# EAGLE design LispBadgeLE (EAGLE 7.6.0)
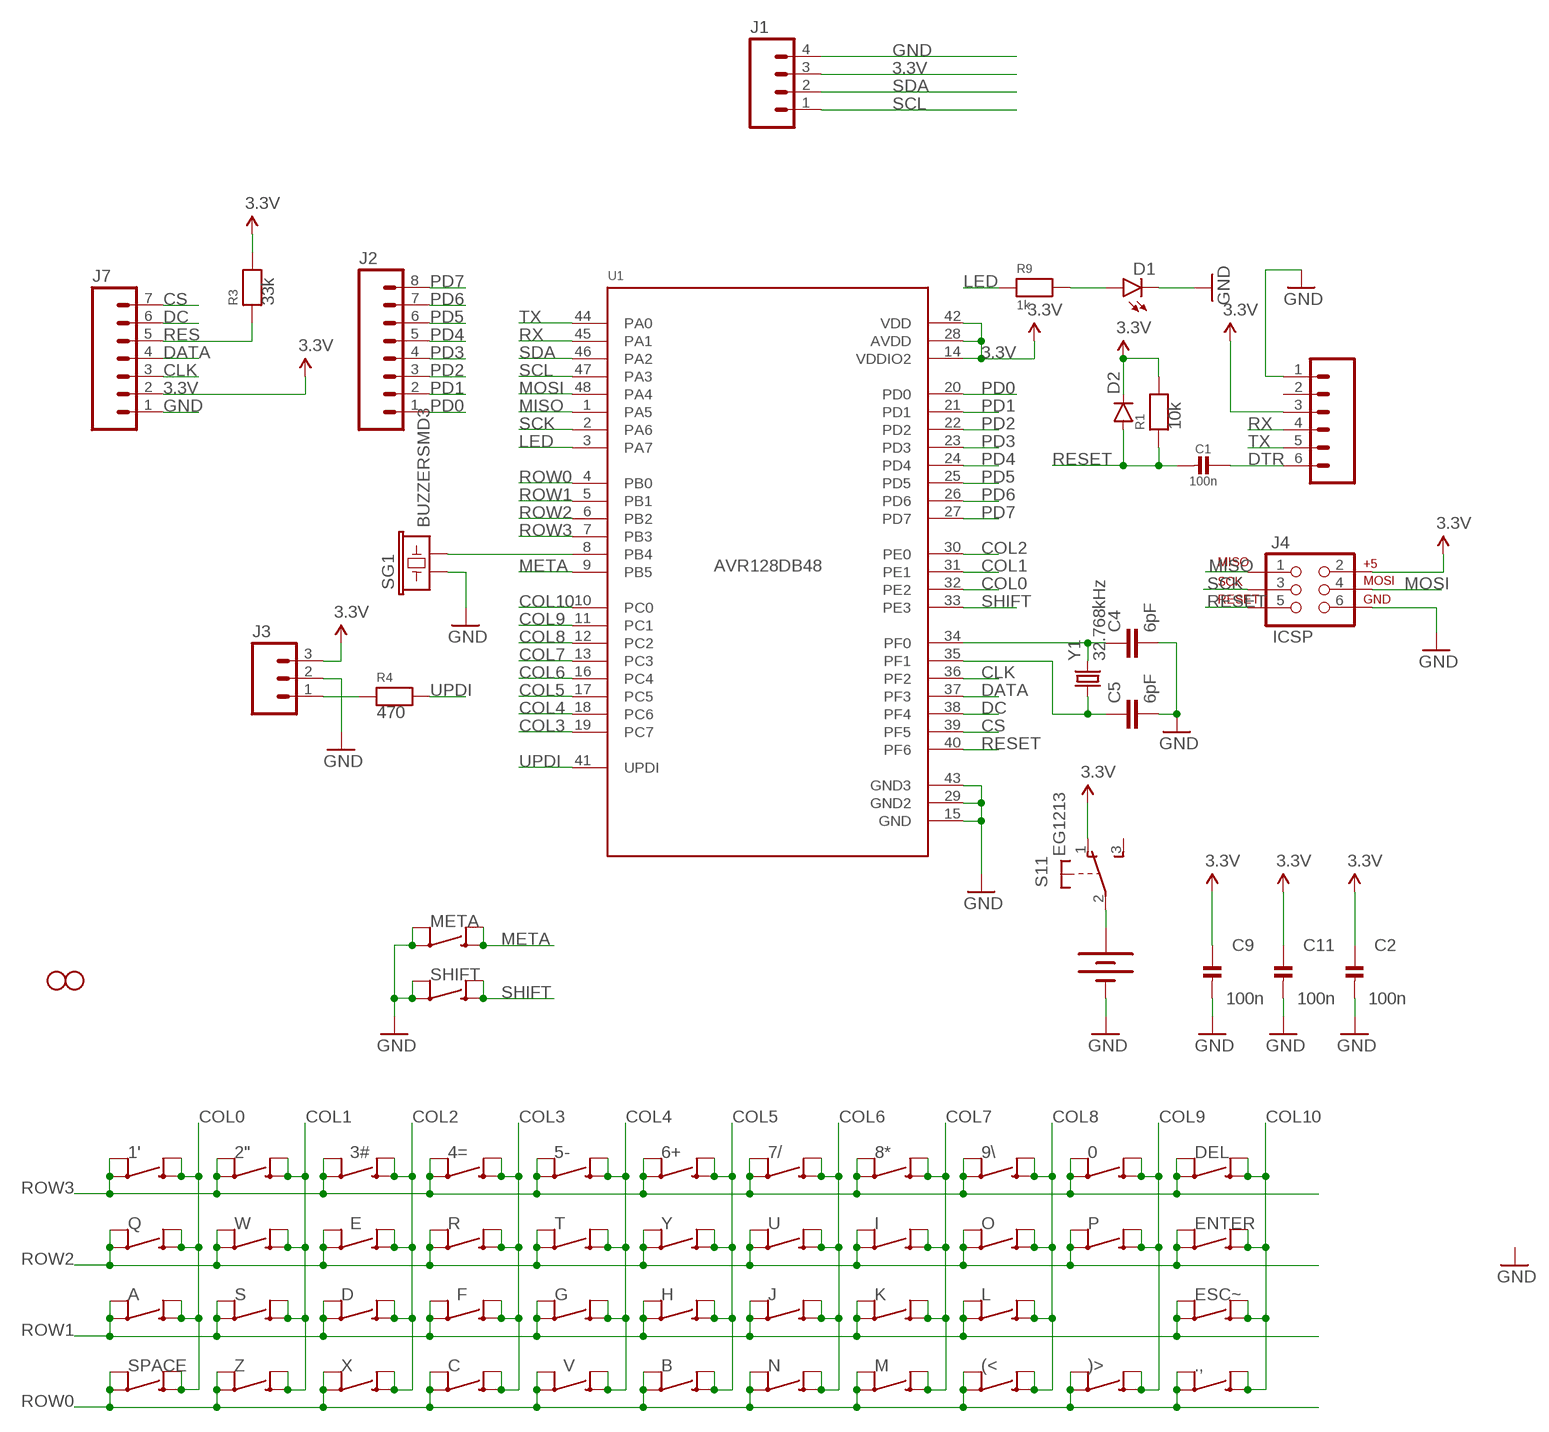
[diagram p0: schematic, sheet 1]

## Parts
0  SWITCH-MOMENTARY-2SMD-4  [TACTILE_SWITCH_TALL]
1'  SWITCH-MOMENTARY-2SMD-4  [TACTILE_SWITCH_TALL]
2"  SWITCH-MOMENTARY-2SMD-4  [TACTILE_SWITCH_TALL]
3#  SWITCH-MOMENTARY-2SMD-4  [TACTILE_SWITCH_TALL]
4=  SWITCH-MOMENTARY-2SMD-4  [TACTILE_SWITCH_TALL]
5-  SWITCH-MOMENTARY-2SMD-4  [TACTILE_SWITCH_TALL]
6+  SWITCH-MOMENTARY-2SMD-4  [TACTILE_SWITCH_TALL]
7/  SWITCH-MOMENTARY-2SMD-4  [TACTILE_SWITCH_TALL]
8*  SWITCH-MOMENTARY-2SMD-4  [TACTILE_SWITCH_TALL]
9\\  SWITCH-MOMENTARY-2SMD-4  [TACTILE_SWITCH_TALL]
(<  SWITCH-MOMENTARY-2SMD-4  [TACTILE_SWITCH_TALL]
)>  SWITCH-MOMENTARY-2SMD-4  [TACTILE_SWITCH_TALL]
.,  SWITCH-MOMENTARY-2SMD-4  [TACTILE_SWITCH_TALL]
A  SWITCH-MOMENTARY-2SMD-4  [TACTILE_SWITCH_TALL]
B  SWITCH-MOMENTARY-2SMD-4  [TACTILE_SWITCH_TALL]
BAT1  20mm coincell  BATTERY20MM_4LEGS  [BATTCON_20MM_4LEGS]
C  SWITCH-MOMENTARY-2SMD-4  [TACTILE_SWITCH_TALL]
C1  100n  CAP_CERAMIC_0805MP  [_0805MP]
C2  100n  CAP_CERAMIC_0805MP  [_0805MP]
C4  6pF  CAP0805  [0805]
C5  6pF  CAP0805  [0805]
C9  100n  CAP_CERAMIC_0805MP  [_0805MP]
C11  100n  CAP_CERAMIC_0805MP  [_0805MP]
D  SWITCH-MOMENTARY-2SMD-4  [TACTILE_SWITCH_TALL]
D1  LED1206-BOTTOM  [LED-1206-BOTTOM]
D2  DIODESOD123  [SOD-123]
DEL  SWITCH-MOMENTARY-2SMD-4  [TACTILE_SWITCH_TALL]
E  SWITCH-MOMENTARY-2SMD-4  [TACTILE_SWITCH_TALL]
ENTER  SWITCH-MOMENTARY-2SMD-4  [TACTILE_SWITCH_TALL]
ESC~  SWITCH-MOMENTARY-2SMD-4  [TACTILE_SWITCH_TALL]
F  SWITCH-MOMENTARY-2SMD-4  [TACTILE_SWITCH_TALL]
G  SWITCH-MOMENTARY-2SMD-4  [TACTILE_SWITCH_TALL]
H  SWITCH-MOMENTARY-2SMD-4  [TACTILE_SWITCH_TALL]
I  SWITCH-MOMENTARY-2SMD-4  [TACTILE_SWITCH_TALL]
J  SWITCH-MOMENTARY-2SMD-4  [TACTILE_SWITCH_TALL]
J1  M04LONGPADS  [1X04_LONGPADS]
J2  M08LONGPADS  [1X08_LONGPADS]
J3  M03LONGPADS  [1X03_LONGPADS]
J4  ICSP  AVR_SPI_PRG_6PTH  [2X3]
J7  M07  [1X07]
JP1  M06LONGPADS  [1X06_LONGPADS]
JP4  STAND-OFF  [STAND-OFF]
JP5  STAND-OFF  [STAND-OFF]
K  SWITCH-MOMENTARY-2SMD-4  [TACTILE_SWITCH_TALL]
L  SWITCH-MOMENTARY-2SMD-4  [TACTILE_SWITCH_TALL]
M  SWITCH-MOMENTARY-2SMD-4  [TACTILE_SWITCH_TALL]
META  SWITCH-MOMENTARY-2SMD-4  [TACTILE_SWITCH_TALL]
N  SWITCH-MOMENTARY-2SMD-4  [TACTILE_SWITCH_TALL]
O  SWITCH-MOMENTARY-2SMD-4  [TACTILE_SWITCH_TALL]
P  SWITCH-MOMENTARY-2SMD-4  [TACTILE_SWITCH_TALL]
Q  SWITCH-MOMENTARY-2SMD-4  [TACTILE_SWITCH_TALL]
R  SWITCH-MOMENTARY-2SMD-4  [TACTILE_SWITCH_TALL]
R1  10k  RESISTOR_0805MP  [_0805MP]
R3  33k  RESISTOR_0805MP  [_0805MP]
R4  470  RESISTOR_0805MP  [_0805MP]
R9  1k  RESISTOR_0805MP  [_0805MP]
S  SWITCH-MOMENTARY-2SMD-4  [TACTILE_SWITCH_TALL]
S1  EG1213  [EG1213]
SG1  BUZZERSMD3  [BUZZER-CMT1102]
SHIFT  SWITCH-MOMENTARY-2SMD-4  [TACTILE_SWITCH_TALL]
SPACE  SWITCH-MOMENTARY-2SMD-4  [TACTILE_SWITCH_TALL]
T  SWITCH-MOMENTARY-2SMD-4  [TACTILE_SWITCH_TALL]
U  SWITCH-MOMENTARY-2SMD-4  [TACTILE_SWITCH_TALL]
U1  AVR128DB48  [LQFP48]
V  SWITCH-MOMENTARY-2SMD-4  [TACTILE_SWITCH_TALL]
W  SWITCH-MOMENTARY-2SMD-4  [TACTILE_SWITCH_TALL]
X  SWITCH-MOMENTARY-2SMD-4  [TACTILE_SWITCH_TALL]
Y  SWITCH-MOMENTARY-2SMD-4  [TACTILE_SWITCH_TALL]
Y1  32.768kHz  CRYSTAL3.2X1.5MM  [CRYSTAL-SMD-3.2X1.5MM]
Z  SWITCH-MOMENTARY-2SMD-4  [TACTILE_SWITCH_TALL]

## Nets
3.3V: C2.1 C9.1 C11.1 D2.C J1.3 J3.3 J4.2 J7.2 JP1.3 R1.2 R3.2 S1.1(1:O) U1.14(VDDIO2) U1.28(AVDD) U1.42(VDD)
CLK: J7.3 U1.36(PF2)
COL0: 1'.B1 1'.B2 A.B1 A.B2 Q.B1 Q.B2 SPACE.B1 SPACE.B2 U1.32(PE2)
COL1: 2".B1 2".B2 S.B1 S.B2 U1.31(PE1) W.B1 W.B2 Z.B1 Z.B2
COL2: 3#.B1 3#.B2 D.B1 D.B2 E.B1 E.B2 U1.30(PE0) X.B1 X.B2
COL3: 4=.B1 4=.B2 C.B1 C.B2 F.B1 F.B2 R.B1 R.B2 U1.19(PC7)
COL4: 5-.B1 5-.B2 G.B1 G.B2 T.B1 T.B2 U1.18(PC6) V.B1 V.B2
COL5: 6+.B1 6+.B2 B.B1 B.B2 H.B1 H.B2 U1.17(PC5) Y.B1 Y.B2
COL6: 7/.B1 7/.B2 J.B1 J.B2 N.B1 N.B2 U1.16(PC4) U.B1 U.B2
COL7: 8*.B1 8*.B2 I.B1 I.B2 K.B1 K.B2 M.B1 M.B2 U1.13(PC3)
COL8: 9\\.B1 9\\.B2 (<.B1 (<.B2 L.B1 L.B2 O.B1 O.B2 U1.12(PC2)
COL9: 0.B1 0.B2 )>.B1 )>.B2 P.B1 P.B2 U1.11(PC1)
COL10: .,.B1 .,.B2 DEL.B1 DEL.B2 ENTER.B1 ENTER.B2 ESC~.B1 ESC~.B2 U1.10(PC0)
CS: J7.7 U1.39(PF5)
DATA: J7.4 U1.37(PF3)
DC: J7.6 U1.38(PF4)
DTR: C1.1 JP1.6
GND: BAT1.NEGATIVE(-) C2.2 C4.2 C5.2 C9.2 C11.2 D1.C J1.4 J3.2 J4.6 J7.1 JP1.1 META.A1 META.A2 SG1.1 SHIFT.A1 SHIFT.A2 U1.15(GND) U1.29(GND2) U1.43(GND3)
LED: R9.1 U1.3(PA7)
META: META.B1 META.B2 U1.9(PB5)
MISO: J4.1 U1.1(PA5)
MOSI: J4.4 U1.48(PA4)
N$1: C5.1 U1.35(PF1) Y1.P$1
N$2: C4.1 U1.34(PF0) Y1.P$2
N$3: D1.A R9.2
N$5: BAT1.POSITIVE@1(+) BAT1.POSITIVE@2(+) BAT1.POSITIVE@3(+) BAT1.POSITIVE@4(+) S1.2(1:P)
N$6: SG1.2 U1.8(PB4)
N$8: J3.1 R4.1
PD0: J2.1 U1.20(PD0)
PD1: J2.2 U1.21(PD1)
PD2: J2.3 U1.22(PD2)
PD3: J2.4 U1.23(PD3)
PD4: J2.5 U1.24(PD4)
PD5: J2.6 U1.25(PD5)
PD6: J2.7 U1.26(PD6)
PD7: J2.8 U1.27(PD7)
RES: J7.5 R3.1
RESET: C1.2 D2.A J4.5 R1.1 U1.40(PF6)
ROW0: (<.A1 (<.A2 )>.A1 )>.A2 .,.A1 .,.A2 B.A1 B.A2 C.A1 C.A2 M.A1 M.A2 N.A1 N.A2 SPACE.A1 SPACE.A2 U1.4(PB0) V.A1 V.A2 X.A1 X.A2 Z.A1 Z.A2
ROW1: A.A1 A.A2 D.A1 D.A2 ESC~.A1 ESC~.A2 F.A1 F.A2 G.A1 G.A2 H.A1 H.A2 J.A1 J.A2 K.A1 K.A2 L.A1 L.A2 S.A1 S.A2 U1.5(PB1)
ROW2: E.A1 E.A2 ENTER.A1 ENTER.A2 I.A1 I.A2 O.A1 O.A2 P.A1 P.A2 Q.A1 Q.A2 R.A1 R.A2 T.A1 T.A2 U1.6(PB2) U.A1 U.A2 W.A1 W.A2 Y.A1 Y.A2
ROW3: 0.A1 0.A2 1'.A1 1'.A2 2".A1 2".A2 3#.A1 3#.A2 4=.A1 4=.A2 5-.A1 5-.A2 6+.A1 6+.A2 7/.A1 7/.A2 8*.A1 8*.A2 9\\.A1 9\\.A2 DEL.A1 DEL.A2 U1.7(PB3)
RX: JP1.4 U1.45(PA1)
SCK: J4.3 U1.2(PA6)
SCL: J1.1 U1.47(PA3)
SDA: J1.2 U1.46(PA2)
SHIFT: SHIFT.B1 SHIFT.B2 U1.33(PE3)
TX: JP1.5 U1.44(PA0)
UPDI: R4.2 U1.41(UPDI)
Unconnected: JP1.2 S1.3(1:S) S1.MT1(MT) S1.MT2(MT)

## Library data of the parts
0 1' 2" 3# 4= 5- 6+ 7/ 8* 9\\ (< )> ., A B C D DEL E ENTER ESC~ F G H I J K L M META N O P Q R S SHIFT SPACE T U V W X Y Z = technoblogy:SWITCH-MOMENTARY-2: Various NO switches- pushbuttons, reed, etc; PROD_ID: SWCH-11966
BAT1 = SparkFun-Electromechanical:BATTERY: Battery Holders Various common sizes : AA, AAA, 18650 (PRT-12895), 20mm coin cell and 12mm coin cell. 20MM_4LEGS, BATT-10373; PROD_ID: BATT-10373
C1 C2 C9 C11 = microbuilder:CAP_CERAMIC: Ceramic Capacitors For new designs, use the packages preceded by an '_' character since they are more reliable: The following footprints should be used on most boards: _0402 - Standard footprint for regular board layouts _0603 - Standard footprint for regular board layouts _0805 - Standard footprint for regular board layouts _1206 - Standard footprint for regular board layouts For extremely tight-pitch boards where space is at a premium, the following 'micro-pitch' footprints can be used (smaller pads, no silkscreen outline, etc.): _0402MP - Micro-pitch footprint for very dense/compact boards _0603MP - Micro-pitch footprint for very dense/compact boards _0805MP - Micro-pitch footprint for very dense/compact boards _1206MP - Micro-pitch footprint for very dense/compact boards
C4 C5 = SparkFun-Capacitors:CAP: Capacitor Standard 0603 ceramic capacitor, and 0.1" leaded capacitor.
D1 = SparkFun-LED:LED: LEDs Standard schematic elements and footprints for 5mm, 3mm, 1206, and 0603 sized LEDs. 5mm - Spark Fun Electronics SKU : COM-00529 (and others)
D2 = SparkFun-DiscreteSemi:DIODE: Diode These are standard reverse protection diodes and small signal diodes. SMA package can handle up to about 1A. SOD-323 can handle about 200mA. What the SOD-323 package when ordering, there are some mfgs out there that are 5-pin packages.
J1 = SparkFun-Connectors:M04: Header 4 Standard 4-pin 0.1" header. Use with straight break away headers (SKU : PRT-00116), right angle break away headers (PRT-00553), swiss pins (PRT-00743), machine pins (PRT-00117), and female headers (PRT-00115). Molex polarized connector foot print use with SKU : PRT-08231 with associated crimp pins and housings. 1MM SMD Version SKU: PRT-10208; PROD_ID: CONN-09696
J2 = SparkFun-Connectors:M08: Header 8 Standard 8-pin 0.1" header. Use with straight break away headers (SKU : PRT-00116), right angle break away headers (PRT-00553), swiss pins (PRT-00743), machine pins (PRT-00117), and female headers (PRT-00115).
J3 = SparkFun-Connectors:M03: Header 3 Standard 3-pin 0.1" header. Use with straight break away headers (SKU : PRT-00116), right angle break away headers (PRT-00553), swiss pins (PRT-00743), machine pins (PRT-00117), and female headers (PRT-00115). Molex polarized connector foot print use with SKU : PRT-08232 with associated crimp pins and housings.
J4 = SparkFun:AVR_SPI_PRG_6: AVR ISP 6 Pin This is the reduced ISP connector for AVR programming. Common on Arduino. This footprint will take up less PCB space and can be used with a 10-pin to 6-pin adapter such as SKU: BOB-08508
J7 = SparkFun-Connectors:M07: Header 7 Standard 7-pin 0.1" header. Use with straight break away headers (SKU : PRT-00116), right angle break away headers (PRT-00553), swiss pins (PRT-00743), machine pins (PRT-00117), and female headers (PRT-00115). NOTES ON THE VARIANTS LOCK and LOCK_LONGPADS... This footprint was designed to help hold the alignment of a through-hole component (i.e. 7-pin header) while soldering it into place. You may notice that each hole has been shifted either up or down by 0.005 of an inch from it's more standard position (which is usually a perfectly straight line). This slight alteration caused the pins (the squares in the middle) to touch the edges of the holes. Because they are alternating, it causes a "brace" to hold the header in place. 0.005 has proven to be the perfect amount of "off-center" position when using our standard breakaway headers. Although looks a little odd when you look at the bare footprint, once you have a header in there, the alteration is very hard to notice. Also, if you push a header all the way into place, it is covered up entirely on the bottom side. This idea of altering the position of holes to aid alignment will be further integrated into the Sparkfun Library for other footprints. It can help hold any component with 3 or more connection pins.
JP1 = SparkFun-Connectors:M06: Header 6 Standard 6-pin 0.1" header. Use with straight break away headers (SKU : PRT-00116), right angle break away headers (PRT-00553), swiss pins (PRT-00743), machine pins (PRT-00117), and female headers (PRT-00115). Molex polarized connector foot print use with SKU : PRT-08094 with associated crimp pins and housings. NOTES ON THE VARIANTS LOCK and LOCK_LONGPADS... This footprint was designed to help hold the alignment of a through-hole component (i.e. 6-pin header) while soldering it into place. You may notice that each hole has been shifted either up or down by 0.005 of an inch from it's more standard position (which is a perfectly straight line). This slight alteration caused the pins (the squares in the middle) to touch the edges of the holes. Because they are alternating, it causes a "brace" to hold the component in place. 0.005 has proven to be the perfect amount of "off-center" position when using our standard breakaway headers. Although looks a little odd when you look at the bare footprint, once you have a header in there, the alteration is very hard to notice. Also,if you push a header all the way into place, it is covered up entirely on the bottom side. This idea of altering the position of holes to aid alignment will be further integrated into the Sparkfun Library for other footprints. It can help hold any component with 3 or more connection pins.
JP4 JP5 = SparkFun:STAND-OFF: Stand Off This is the mechanical footprint for a #4 phillips button head screw. Use the keepout ring to avoid running the screw head into surrounding components. SKU : PRT-00447
R1 R3 R4 R9 = microbuilder:RESISTOR: Resistors 0402 - 0402 Surface Mount Package 22 Ohm 1% 1/16W [Digikey: 311-22.0LRTR-ND] 33 Ohm 5% 1/16W 1.0K 5% 1/16W 1.5K 5% 1/16W 2.0K 1% 1/16W 10.0K 1% 1/16W [Digikey: 311-10.0KLRTR-ND] 10.0K 5% 1/16W [Digikey: RMCF0402JT10K0TR-ND] 12.1K 1% 1/16W [Digikey: 311-22.0LRTR-ND] 100.0K 5% 1/16W 0603 - 0603 Surface Mount Package 0 Ohm 1/10 Watt 1% Resistor 15 Ohm 1/10 Watt 1% Resistor 33 Ohm 1/10 Watt 1% Resistor 49.9 Ohm 1/10 Watt 1% Resistor 100 Ohm 1/10 Watt 1% Resistor 150 Ohm 1/10 Watt 1% Resistor 240 Ohm 1/10 Watt 1% Resistor 390 Ohm 1/10 Watt 1% Resistor 560 Ohm 1/10 Watt 1% Resistor 680 Ohm 1/10 Watt 1% Resistor 750 Ohm 1/10 Watt 1% Resistor 1.0K Ohm 1/10 Watt 1% Resistor 1.5K Ohm 1/10 Watt 1% Resistor 2.0K Ohm 1/10 Watt 1% Resistor 2.2K Ohm 1/10 Watt 1% Resistor 3.3K Ohm 1/10 Watt 1% Resistor 4.7K Ohm 1/10 Watt 1% Resistor 10.0K Ohm 1/10 Watt 1% Resistor 12.0K Ohm 1/10 Watt 1% Resistor 12.1K Ohm 1/10 Watt 1% Resistor 20.0K Ohm 1/10 Watt 1% Resistor 33.0K Ohm 1/10 Watt 1% Resistor 100.0K Ohm 1/10 Watt 1% Resistor 0805 - 0805 Surface Mount Package 0 Ohm 1/8 Watt 1% Resistor 33 Ohm 1/8 Watt 1% Resistor 100 Ohm 1/8 Watt 1% Resistor 150 Ohm 1/8 Watt 1% Resistor 200 Ohm 1/8 Watt 1% Resistor 240 Ohm 1/8 Watt 1% Resistor 330 Ohm 1/8 Watt 1% Resistor 390 Ohm 1/8 Watt 1% Resistor 470 Ohm 1/8 Watt 1% Resistor 1.0K Ohm 1/8 Watt 1% Resistor 1.5K Ohm 1/8 Watt 1% Resistor 2.0K Ohm 1/8 Watt 1% Resistor 4.7K Ohm 1/8 Watt 1% Resistor 5.1K Ohm 1/8 Watt 1% Resistor 5.6K Ohm 1/8 Watt 1% Resistor 10.0K Ohm 1/8 Watt 1% Resistor 22.0K Ohm 1/8 Watt 1% Resistor 33.0K Ohm 1/8 Watt 1% Resistor 100K Ohm 1/8 Watt 1% Resistor 1206 - 1206 Surface Mount Package 2012 - 2010 Surface Mount Package 0.11 Ohm 1/2 Watt 1% Resistor - Digikey: RHM.11UCT-ND
S1 = adafruit:EG1213: E-Switch right-angle slide SPDT Part #EG1213 http://www.ladyada.net/library/eagle
SG1 = SparkFun-Electromechanical:BUZZER: Buzzer 12mm Spark Fun Electronics SKU : Comp-Buzzer
U1 = technoblogy:AVR128DB48: AVR128DB48 MCU QFP48 Package ARM Cortex M0, 50MHz Operation, 8 Channel 10-Bit ADC, 1²C, 2xSPI, UART, 2x16 Bit and 2x32 Bit Timers, Internal 12MHz Oscillator, 1.8-3.6V operation. Model Flash SRAM Part N°: Digikey Mouser LPC1113 24KB 8KB LPC1113FBD48/301 TBD TBD LPC1114 32KB 8KB LPC1114FBD48/301 568-4950-ND 771-LPC1114FBD483011; DIGIKEY#: 568-4950-ND; MANF: NXP; MANF#: LPC1114FBD48/301,1
Y1 = SparkFun-FreqCtrl:CRYSTAL: Various standard crystals. Proven footprints.; PROD_ID: XTAL-13062

## Net classes
0 default: width 0.152 mm, drill 0.305 mm, clearance 0.152 mm

## Board
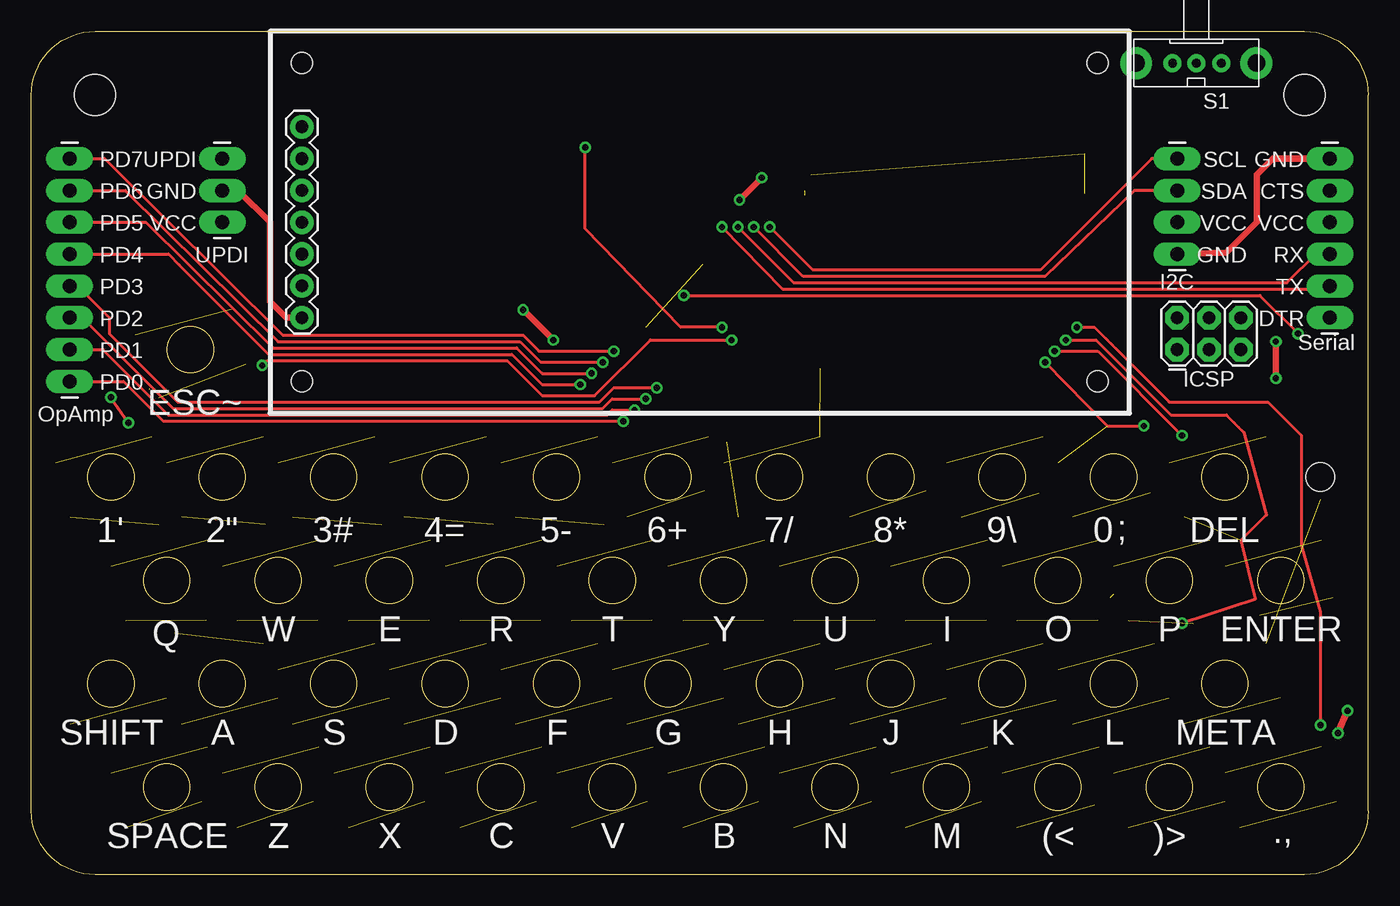
[diagram p1: board, top side]
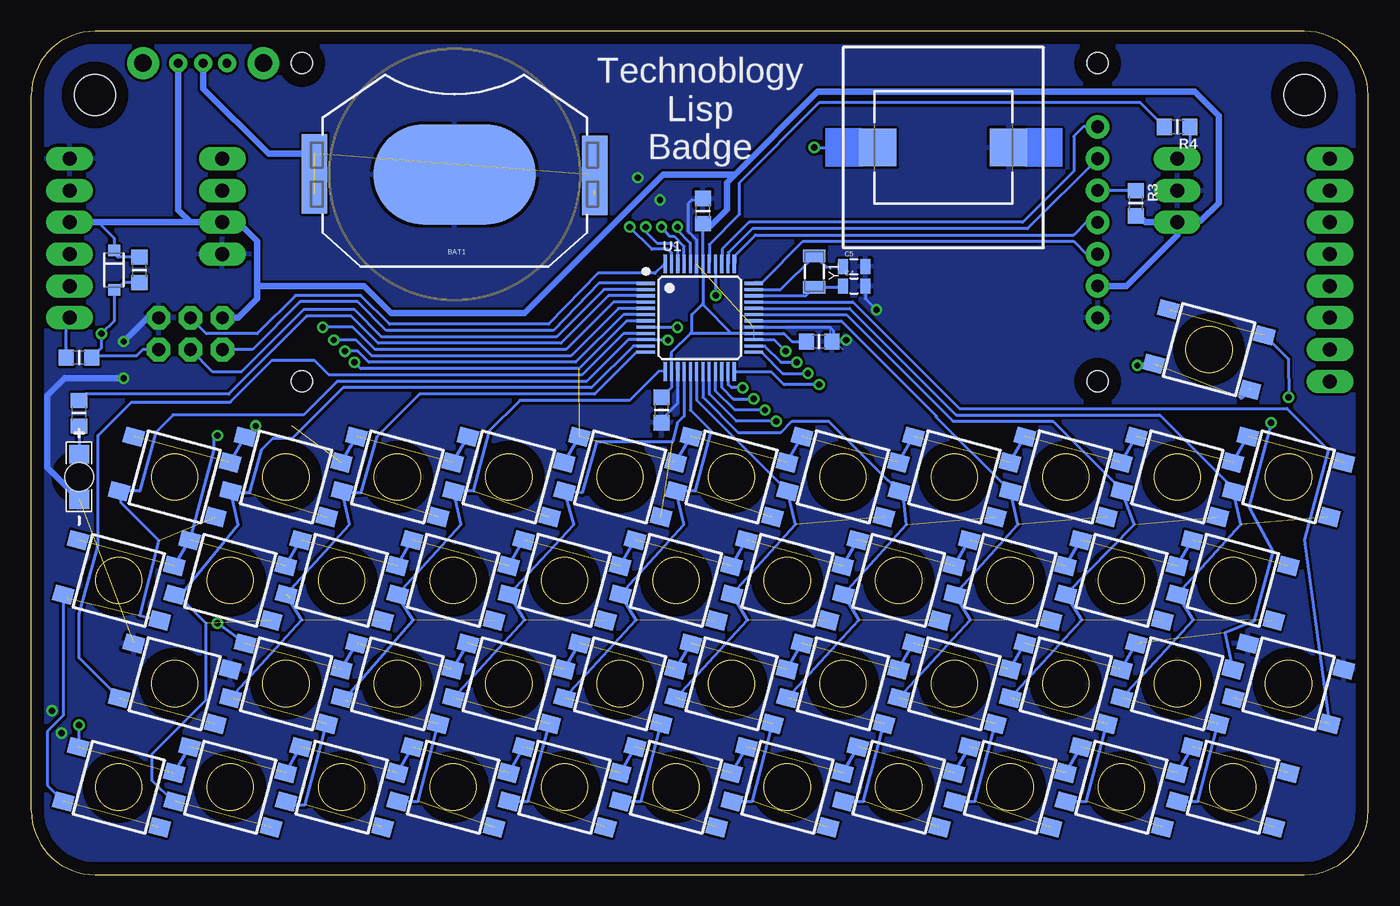
[diagram p2: board, bottom side, seen from below]

Size 106.68 x 67.31 mm. Coordinates in mm from the lower left corner, seen from the top.
Outline: 0,5.08 0,62.23 arc-90 5.08,67.31 101.6,67.31 arc-90 106.68,62.23 106.68,5.08 arc-90 101.6,0 5.08,0 arc-90 0,5.08
Copper layers (1*16): Top 0.035mm / dielectric 1.5mm / Bottom 0.035mm
Design rules "default *": minimum track width 10mil, minimum drill 24mil, track to track 8mil, track to pad 8mil, pad to pad 8mil, via to via 8mil, smd to smd 8mil, copper to edge 40mil, drill to drill 8mil, minimum pad ring 10mil, minimum via ring 8mil, stop-mask expansion 4mil, vias tented up to drill 20mil, thermal gap 10mil
Holes 1.7 mm at 21.59,64.77 85.09,64.77 21.59,39.37 85.09,39.37

### Footprints (pad centres in the part's own frame; a part is rotated, then mirrored left to right if it is on the bottom)
TACTILE_SWITCH_TALL = smd 1.55 x 1.3: A1 -3.975,-2.25; A2 3.975,-2.25; B1 -3.975,2.25; B2 3.975,2.25
BATTCON_20MM_4LEGS = smd 13 x 8: NEGATIVE 0,0 | smd 2.032 x 3.175: POSITIVE@1 -11.176,1.651; POSITIVE@2 -11.176,-1.524; POSITIVE@3 11.176,1.524; POSITIVE@4 11.176,-1.651
_0805MP = smd 1.2 x 1.3: 1 -1.016,0; 2 1.016,0
0805 = smd 0.8 x 1.2: 1 -0.9,0; 2 0.9,0
LED-1206-BOTTOM = smd 1.5 x 1.6: A -1.8,0; C 1.8,0 | hole 2.3: 0,0
SOD-123 = smd 0.9 x 0.95: A 1.575,0; C -1.575,0
1X04_LONGPADS = drill 1.118 pad 1.88 long: 1 0,0; 2 2.54,0; 3 5.08,0; 4 7.62,0
1X08_LONGPADS = drill 1.118 pad 1.88 long: 1 0,0; 2 2.54,0; 3 5.08,0; 4 7.62,0; 5 10.16,0; 6 12.7,0; 7 15.24,0; 8 17.78,0
1X03_LONGPADS = drill 1.118 pad 1.88 long: 1 0,0; 2 2.54,0; 3 5.08,0
2X3 = drill 1.016 pad 1.88 octagon: 1 0,0; 2 0,2.54; 3 2.54,0; 4 2.54,2.54; 5 5.08,0; 6 5.08,2.54
1X07 = drill 1.016 pad 1.88: 1 0,0; 2 2.54,0; 3 5.08,0; 4 7.62,0; 5 10.16,0; 6 12.7,0; 7 15.24,0
1X06_LONGPADS = drill 1.118 pad 1.88 long: 1 0,0; 2 2.54,0; 3 5.08,0; 4 7.62,0; 5 10.16,0; 6 12.7,0
STAND-OFF = hole 3.302: 0,0
EG1213 = drill 0.7 pad 1.422: 1 -2,0; 2 0,0; 3 1.9,0 | drill 1.4 pad 2.54: MT1 -4.8,0; MT2 4.8,0
BUZZER-CMT1102 = smd 3 x 3: 1 -5.23,0; 2 5.23,0
LQFP48 = smd 1.5 x 0.25: 1 -4.3,2.75; 2 -4.3,2.25; 3 -4.3,1.75; 4 -4.3,1.25; 5 -4.3,0.75; 6 -4.3,0.25; 7 -4.3,-0.25; 8 -4.3,-0.75; 9 -4.3,-1.25; 10 -4.3,-1.75; 11 -4.3,-2.25; 12 -4.3,-2.75; 25 4.3,-2.75; 26 4.3,-2.25; 27 4.3,-1.75; 28 4.3,-1.25; 29 4.3,-0.75; 30 4.3,-0.25; 31 4.3,0.25; 32 4.3,0.75; 33 4.3,1.25; 34 4.3,1.75; 35 4.3,2.25; 36 4.3,2.75 | smd 0.25 x 1.5: 13 -2.75,-4.3; 14 -2.25,-4.3; 15 -1.75,-4.3; 16 -1.25,-4.3; 17 -0.75,-4.3; 18 -0.25,-4.3; 19 0.25,-4.3; 20 0.75,-4.3; 21 1.25,-4.3; 22 1.75,-4.3; 23 2.25,-4.3; 24 2.75,-4.3; 37 2.75,4.3; 38 2.25,4.3; 39 1.75,4.3; 40 1.25,4.3; 41 0.75,4.3; 42 0.25,4.3; 43 -0.25,4.3; 44 -0.75,4.3; 45 -1.25,4.3; 46 -1.75,4.3; 47 -2.25,4.3; 48 -2.75,4.3
CRYSTAL-SMD-3.2X1.5MM = smd 1 x 1.8: P$1 -1.25,0; P$2 1.25,0

### Placement (x,y rotation side)
0  86.36,31.75 165 bottom
1'  6.35,31.75 165 bottom
2"  15.24,31.75 165 bottom
3#  24.13,31.75 165 bottom
4=  33.02,31.75 165 bottom
5-  41.91,31.75 165 bottom
6+  50.8,31.75 165 bottom
7/  59.69,31.75 165 bottom
8*  68.58,31.75 165 bottom
9\\  77.47,31.75 165 bottom
(<  81.91,6.99 165 bottom
)>  90.8,6.99 165 bottom
.,  99.69,6.99 165 bottom
A  15.24,15.24 165 bottom
B  55.25,6.99 165 bottom
BAT1  72.9,55.88 180 bottom
C  37.47,6.99 165 bottom
C1  102.87,41.27 0 bottom
C2  56.39,37.08 270 bottom
C4  41.02,46.99 0 bottom
C5  41.02,48.51 0 bottom
C9  43.82,42.55 0 bottom
C11  53.09,52.96 90 bottom
D  33.02,15.24 165 bottom
D1  102.87,31.75 270 bottom
D2  100.08,48.26 270 bottom
DEL  95.25,31.75 165 bottom
E  28.57,23.5 165 bottom
ENTER  99.69,23.5 165 bottom
ESC~  12.7,41.91 165 bottom
F  41.91,15.24 165 bottom
G  50.8,15.24 165 bottom
H  59.69,15.24 165 bottom
I  73.02,23.5 165 bottom
J  68.58,15.24 165 bottom
J1  91.44,57.15 270 top
J2  3.05,39.37 90 top
J3  15.24,57.15 270 top
J4  91.44,41.91 0 top
J7  21.59,44.45 90 top
JP1  103.63,57.15 270 top
JP4  5.08,62.23 0 top
JP5  101.6,62.23 0 top
K  77.47,15.24 165 bottom
L  86.36,15.24 165 bottom
M  73.02,6.99 165 bottom
META  95.25,15.24 165 bottom
N  64.14,6.99 165 bottom
O  81.91,23.5 165 bottom
P  90.8,23.5 165 bottom
Q  10.79,23.5 165 bottom
R  37.47,23.5 165 bottom
R1  98.04,48.26 90 bottom
R3  18.54,53.59 270 bottom
R4  15.24,59.69 180 bottom
R9  102.87,36.83 270 bottom
S  24.13,15.24 165 bottom
S1  92.96,64.77 180 top
SG1  33.91,58.04 180 bottom
SHIFT  6.35,15.24 165 bottom
SPACE  10.79,6.99 165 bottom
T  46.36,23.5 165 bottom
U  64.14,23.5 165 bottom
U1  53.34,44.45 0 bottom
V  46.36,6.99 165 bottom
W  19.68,23.5 165 bottom
X  28.57,6.99 165 bottom
Y  55.25,23.5 165 bottom
Y1  44.2,48.13 270 bottom
Z  19.68,6.99 165 bottom

### Tracks (layer width: path | path; a pad name or v marks a point on that pad's centre or on a via)
3.3V
  Bottom 0.254: C11.1 53.09,51.44 U1.42 53.09,45.49 50.8,43.2 | JP1.3 102.87,52.07 101.35,52.07 100.08,50.8 100.08,49.78 100.33,49.53 100.13,49.53 D2.C 99.77,49.28 R1.2 | C2.1 55.59,38.9 U1.14 55.63,40.19 55.63,41.66 54.08,43.2 50.8,43.2 | 50.8,43.2 U1.28 46.63,43.2 45.97,42.55 C9.1
  Bottom 0.508: 93.98,52.07 J1.3 90.17,52.07 88.65,50.55 88.65,46.99 | 93.98,52.07 102.87,52.07 104.14,52.07 | J4.2 90.17,44.45 88.65,45.97 88.65,46.99 | 50.55,55.88 43.94,62.48 13.84,62.48 11.94,60.58 11.94,53.59 13.33,52.2 15.11,52.2 J3.3 | J3.3 15.24,51.05 19.3,46.99 J7.2 | R3.2 18.29,52.58 17.78,52.07 J3.3 | C11.1 52.45,51.82 51.18,53.09 51.18,55.24 50.55,55.88 | S1.1 94.96,53.05 93.98,52.07 | 50.55,55.88 56.26,55.88 67.31,44.83 77.98,44.83 80.14,46.99 88.65,46.99
CLK
  Bottom 0.254: U1.36 49,47.24 48.39,47.24 45.09,50.55 23.5,50.55 22.48,49.53 J7.3
COL0  (4 unrouted)
  Bottom 0.254: U1.32 41.39,45.2 32.89,36.7 16.64,36.7 10.41,30.48 10.9,30.48 1'.B2 10.16,27.94 Q.B2 13.97,20.32 A.B2 | SPACE.B2 13.59,5.84 A.B1
COL1  (4 unrouted)
  Bottom 0.254: U1.31 41.65,44.7 33.15,36.2 25.15,36.2 20.07,31.11 20.04,30.99 2".B2 18.67,27.94 W.B2 | S.B2 22.86,20.32 W.B2 | W.B2 24.13,22.86 | Z.B2 22.48,5.84 S.B1
COL2  (4 unrouted)
  Bottom 0.254: U1.30 42.04,44.2 34.42,36.58 34.52,36.58 3#.B2 27.94,27.94 E.B2 31.75,20.32 D.B2 | X.B2 31.37,5.84 D.B1
COL3  (4 unrouted)
  Bottom 0.254: U1.19 53.09,38.1 50.29,35.31 46.86,35.31 45.97,36.2 43.05,36.2 38.35,31.5 38.33,31.5 4=.B2 37.07,30.24 36.83,27.94 R.B2 40.64,20.32 F.B2 | C.B2 40.26,5.84 F.B1
COL4  (4 unrouted)
  Bottom 0.254: U1.18 53.59,37.86 5-.B2 | 5-.B2 46.33,30.08 | G.B2 49.53,20.32 T.B2 45.72,27.94 5-.B2 | V.B2 49.15,5.84 G.B1
COL5  (4 unrouted)
  Bottom 0.254: H.B2 58.42,20.32 Y.B2 54.61,27.94 6+.B2 53.72,30.61 52.45,35.43 54.09,37.07 U1.17 | B.B2 58.04,5.84 H.B1
COL6  (4 unrouted)
  Bottom 0.254: J.B2 67.31,20.32 U.B2 63.37,27.94 7/.B2 62.74,30.48 61.6,34.54 55.5,34.54 55.12,36.07 54.59,36.6 U1.16 | N.B2 67.06,5.84 J.B1
COL7  (4 unrouted)
  Bottom 0.254: U1.13 56.6,40.18 58.93,37.85 67.69,37.85 70.1,35.43 71.37,30.61 72.62,30.61 8*.B2 72.39,27.94 I.B2 77.08,21.98 | 77.08,21.98 76.94,21.84 76.94,22.12 | K.B2 81.77,13.97 76.2,20.32 77.22,21.84 77.08,21.98 | M.B2 75.82,5.84 K.B1
COL8  (5 unrouted)
  Bottom 0.254: (<.B2 86.08,5.59 84.84,5.59 L.B1 | 86.08,22.1 85.85,22.1 | L.B2 85.09,20.32 O.B2 81.28,27.94 9\\.B2 81.77,30.48 80.39,30.48 79.12,34.92 75.69,38.35 61.72,38.35 58.38,41.7 U1.12
COL9  (3 unrouted)
  Bottom 0.254: 94.97,22.1 P.B2 | 94.97,22.1 94.74,22.1 92.71,20.07 92.71,13.97 97.03,9.65 97.03,7.49 95.38,5.84 )>.B2 | 94.97,22.1 90.17,27.94 0.B2 90.66,30.48 89.28,30.48 88.33,33.91 87.44,34.8 85.85,34.8 81.79,38.86 61.98,38.86 58.64,42.2 U1.11
COL10  (via drill 0.5)  (5 unrouted)
  Top 0.254: v18.41,40.64 18.8,41.02 37.97,41.02 40.77,38.23 44.96,38.23 49.4,42.67 v55.88,42.67
  Bottom 0.254: 103.86,22.1 ENTER.B2 104.12,12.72 105.41,11.43 105.41,7.13 .,.B2 | ENTER.B1 98.04,20.7 96.52,26.67 99.55,29.7 99.55,30.48 DEL.B2 98.04,30.61 96.77,35.31 95.38,36.7 84.96,36.7 82.3,39.37 62.36,39.37 59.03,42.7 U1.10 57.61,42.67 v55.88,42.67 | ESC~.B2 18.29,40.77 v18.41,40.64
  Bottom 0.406: 9.45,38.81 10.16,38.1
CS
  Bottom 0.254: U1.39 51.56,48.78 51.56,49.91 49.4,52.07 27.56,52.07 23.5,56.13 23.5,58.93 22.73,59.69 J7.7
DATA
  Bottom 0.254: U1.37 50.55,48.79 50.55,49.4 48.9,51.05 23.5,51.05 22.48,52.07 J7.4
DC
  Bottom 0.254: J7.6 27.18,51.56 49.15,51.56 51.05,49.66 51.05,48.79 U1.38
DTR
  Bottom 0.254: C1.1 103.89,44.2 JP1.6
GND  (via drill 0.5)  (2 unrouted)
  Top 0.254: 103.5,57.28 JP1.1 | 101.47,57.28 101.6,57.15
  Top 0.508: v39.24,45.09 v41.66,42.67 | J1.4 95.38,49.66 97.79,52.07 97.79,55.88 99.06,57.15 101.6,57.15 JP1.1 | J3.2 16.51,54.61 19.05,52.07 19.05,45.72 20.32,44.45 J7.1 | v99.31,42.55 v99.31,39.62 | v104.27,11.3 v105.03,13.08 | v56.52,53.85 v58.29,55.63
  Bottom 0: U1.29 49.04,42.69 | 42.94,43.7 42.94,42.94 41.91,41.91
  Bottom 0.254: U1.43 53.59,50.67 54.23,51.31 54.23,53.59 53.98,53.85 C11.2 | META.A1 90.17,16.51 | C2.2 56.13,36.32 56.13,36.58 55.12,37.59 55.12,40.18 U1.15 | U1.29 42.94,43.7 42.67,43.43 42.67,42.67 C9.2 42.67,42.42 v41.66,42.67 | C4.2 40.12,45.96 v39.24,45.09
  Bottom 0.508: J4.6 97.41,44.45 v99.31,42.55 | v99.31,39.62 104.01,39.62 105.41,38.23 105.41,32.49 D1.C
  pour Bottom: 0,67.31 106.68,67.31 106.68,0 0,0
LED
  Bottom 0.254: R9.1 102.36,38.35 90.93,38.35 84.71,44.58 81.15,44.58 78.99,42.42 64.39,42.42 60.61,46.2 U1.3
META  (1 unrouted)
  Bottom 0.254: META.B2 102.87,17.29 102.87,20.83 101.35,26.29 101.35,35.05 98.68,37.72 90.8,37.72 87.5,41.02 84.07,41.02 82.93,39.88 62.74,39.88 59.42,43.2 U1.9
MISO
  Bottom 0.254: U1.1 61.39,47.2 65.02,43.43 78.36,43.43 80.64,45.72 85.22,45.72 89.03,41.91 J4.1
MOSI
  Bottom 0.254: U1.48 56.15,48.75 56.9,48.01 61.47,48.01 65.41,43.94 78.1,43.94 80.39,46.23 85.6,46.23 88.65,43.18 92.71,43.18 J4.4
N$1
  Bottom 0.254: 44.22,49.4 Y1.P$1 | Y1.P$1 43.21,48.49 C5.1 | U1.35 46.88,46.7 Y1.P$1
N$2
  Bottom 0.254: 44.22,46.86 Y1.P$2 | Y1.P$2 41.94,46.88 C4.1 | U1.34 44.88,46.2 Y1.P$2
N$3
  Bottom 0.254: R9.2 D1.A
N$4
  Bottom 0.254: 53.98,43.31 53.98,44.7 53.09,45.59
N$5  (3 unrouted)
  Bottom 0.508: BAT1.POSITIVE@4 87.76,57.53 92.96,62.74 S1.2 | 61.72,54.61 62.23,55.88 60.96,55.88 60.96,56.64 BAT1.POSITIVE@2
N$6  (via drill 0.5)
  Top 0.254: v55.12,43.69 51.82,43.69 44.2,51.56 v44.2,58.04
  Bottom 0.254: v44.2,58.04 SG1.2 | U1.8 55.88,43.7 v55.12,43.69
N$8
  Bottom 0.254: R4.1 14.22,58.17 J3.1
PD0  (via drill 0.5)
  Top 0.254: J2.1 7.37,39.37 10.54,36.2 v47.24,36.2
  Bottom 0.254: v47.24,36.2 50.42,36.2 52.58,38.35 52.58,40.14 U1.20
PD1  (via drill 0.5)
  Top 0.254: J2.2 5.71,41.91 10.92,36.7 45.97,36.7 46.36,37.08 v48.13,37.08
  Bottom 0.254: v48.13,37.08 50.55,37.08 52.07,38.61 52.07,40.13 U1.21
PD2  (via drill 0.5)
  Top 0.254: J2.3 4.06,44.45 11.3,37.21 45.59,37.21 46.36,37.97 v49.02,37.97
  Bottom 0.254: U1.22 51.56,40.12 51.56,38.86 50.67,37.97 v49.02,37.97
PD3  (via drill 0.5)
  Top 0.254: v49.91,38.86 46.48,38.86 45.34,37.72 11.68,37.72 6.22,43.18 6.22,44.45 3.68,46.99 J2.4
  Bottom 0.254: v49.91,38.86 50.8,38.86 51.05,39.12 51.05,40.11 U1.23
PD4  (via drill 0.5)
  Top 0.254: 11.56,48.9 11.8,48.67 | 11.8,48.67 18.92,41.53 38.35,41.53 40.77,39.12 v43.82,39.12 | J2.5 10.94,49.53 11.8,48.67
  Bottom 0.254: v43.82,39.12 46.61,39.12 47.64,40.15 U1.24
PD5  (via drill 0.5)
  Top 0.254: J2.6 9.14,52.07 19.3,42.04 38.74,42.04 40.77,40.01 v44.7,40.01
  Bottom 0.254: U1.25 48.43,41.7 46.74,40.01 v44.7,40.01
PD6  (via drill 0.5)
  Top 0.254: J2.7 7.49,54.61 19.68,42.55 38.99,42.55 40.64,40.89 v45.59,40.89
  Bottom 0.254: v45.59,40.89 46.86,40.89 48.17,42.2 U1.26
PD7  (via drill 0.5)
  Top 0.254: J2.8 5.84,57.15 20.07,43.05 39.24,43.05 40.51,41.78 v46.48,41.78
  Bottom 0.254: v46.48,41.78 47.4,42.7 U1.27
RES
  Bottom 0.254: R3.1 J7.5
RESET  (via drill 0.5)
  Top 0.254: v52.07,46.23 98.04,46.23 v101.09,43.18
  Bottom 0.254: J4.5 97.79,41.91 98.3,41.4 101.73,41.4 C1.2 101.09,42.04 v101.09,43.18 100.08,44.2 D2.A 99.26,47.24 R1.1 | U1.40 52.09,46.25 v52.07,46.23
ROW0  (via drill 0.5)  (11 unrouted)
  Top 0.254: v102.87,11.94 102.87,20.95 101.35,26.29 101.35,35.05 98.68,37.72 90.8,37.72 84.84,43.69 v83.44,43.69
  Bottom 0.254: SPACE.A2 Z.A1 | Z.A2 X.A1 | X.A2 C.A1 | C.A2 V.A1 | V.A2 B.A1 | B.A2 N.A1 | N.A2 M.A1 | M.A2 (<.A1 | )>.A1 (<.A2 | .,.A1 )>.A2 | U1.4 60.22,45.7 64.01,41.91 79.25,41.91 81.03,43.69 v83.44,43.69 | v102.87,11.94 .,.A2
ROW1  (via drill 0.5)  (10 unrouted)
  Top 0.254: v91.82,20.07 97.66,21.97 96.52,26.67 98.55,28.7 96.77,35.31 95.38,36.7 90.93,36.7 84.96,42.67 v82.55,42.67 | v6.35,38.1 v7.75,36.07
  Bottom 0.254: L.A1 K.A2 | K.A1 J.A2 | J.A1 H.A2 | H.A1 G.A2 | G.A1 F.A2 | F.A1 D.A2 | D.A1 S.A2 | S.A1 A.A2 | U1.5 59.83,45.2 63.63,41.4 79.5,41.4 80.77,42.67 v82.55,42.67 | v91.82,20.07 L.A2 | ESC~.A1 6.37,41.17 v6.35,38.1 | v7.75,36.07 9.53,29.34 7.62,25.78 9.14,20.19 11.43,19.3 A.A1
ROW2  (via drill 0.5)  (11 unrouted)
  Top 0.254: v91.82,35.05 85.09,41.78 v81.66,41.78
  Bottom 0.254: W.A1 Q.A2 | E.A1 W.A2 | R.A1 E.A2 | T.A1 R.A2 | Y.A1 T.A2 | U.A1 Y.A2 | I.A1 U.A2 | O.A1 I.A2 | P.A1 O.A2 | ENTER.A1 P.A2 92.08,34.04 92.08,34.8 v91.82,35.05 | U1.6 59.44,44.7 63.25,40.89 79.76,40.89 80.64,41.78 v81.66,41.78
ROW3  (via drill 0.5)  (11 unrouted)
  Top 0.254: v80.9,40.89 85.85,35.81 v88.77,35.81
  Bottom 0.254: DEL.A1 0.A2 88.75,35.81 v88.77,35.81 | 0.A1 9\\.A2 | 9\\.A1 8*.A2 | 8*.A1 7/.A2 | 7/.A1 6+.A2 | 6+.A1 5-.A2 | 5-.A1 4=.A2 | 4=.A1 3#.A2 | 3#.A1 2".A2 | 2".A1 1'.A2 | U1.7 59.18,44.2 62.99,40.39 80.39,40.39 v80.9,40.89
RX  (via drill 0.5)
  Top 0.254: v56.39,51.69 60.83,47.24 100.2,47.24 102.49,49.53 JP1.4
  Bottom 0.254: U1.45 54.59,50.15 55.37,50.93 55.75,50.93 v56.39,51.69
SCK
  Bottom 0.254: U1.2 61,46.7 64.77,42.93 78.74,42.93 80.9,45.09 84.96,45.09 89.92,40.13 92.2,40.13 J4.3
SCL  (via drill 0.5)
  Top 0.254: v58.93,51.69 62.36,48.26 80.52,48.26 89.41,57.15 J1.1
  Bottom 0.254: v58.93,51.69 57.15,49.91 55.88,49.91 55.59,49.62 U1.47
SDA  (via drill 0.5)
  Top 0.254: J1.2 88.01,54.61 80.9,47.75 61.6,47.75 v57.66,51.69
  Bottom 0.254: v57.66,51.69 57.66,51.31 56.77,50.42 55.63,50.42 55.12,49.91 55.12,48.78 U1.46
SHIFT  (1 unrouted)
  Bottom 0.254: U1.33 41.13,45.7 32.64,37.21 6.48,37.21 3.17,33.91 5.08,26.73 SHIFT.B1
TX  (via drill 0.5)
  Top 0.254: JP1.5 103.38,46.74 59.94,46.74 v55.12,51.69
  Bottom 0.254: U1.44 54.1,50.42 55.12,51.44 v55.12,51.69
UPDI
  Bottom 0.254: R4.2 18.16,61.59 43.82,61.59 50.17,55.24 50.17,52.7 52.58,50.29 52.58,48.99 U1.41
(copper drawn outside any net)
  shapes: Bottom area x2

### Text on the board
tPlace: PD7 | UPDI | SCL | GND | PD6 | GND | SDA | CTS | PD5 | VCC | VCC | VCC | PD4 | UPDI | GND | RX | I2C | PD3 | TX | PD2 | DTR | Serial | PD1 | PD0 | ICSP | OpAmp | ;
bPlace: Technoblogy / Lisp / Badge